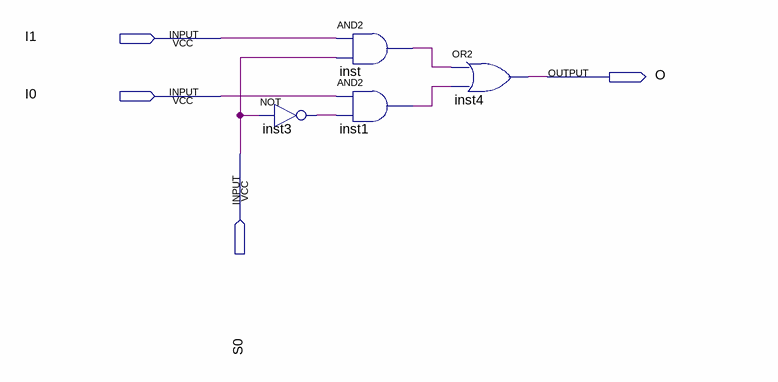
[diagram p0: schematic sheet]
// Quartus schematic MUX2.bdf as structural Verilog: 4 symbols, 4 pins
module MUX2 (
  input  I1,
  input  I0,
  input  S0,
  output O
);

  wire inst1_out, inst3_out, inst_out;

  not inst3 (inst3_out, S0);
  and inst (inst_out, I1, S0);
  and inst1 (inst1_out, I0, inst3_out);
  or inst4 (O, inst_out, inst1_out);
endmodule
